# Altium schematic sheet Power.SchDoc: Power
size A4; Date: Not used; ApprovedBy: Not used; CheckedBy: Not used; Author: Not used; CompanyName: STMicroelectronics; DrawnBy: Not used; Engineer: Not used; Organization: Not used; Address1: Not used; Address2: Not used; Address3: Not used; Address4: Not used; DocumentNumber: Not used; Revision: Not used; SheetNumber: 5; SheetTotal: 7; CurrentTime: Not used; CurrentDate: Not used; Time: Not used; DocumentFullPathAndName: Not used; DocumentName: Not used; ModifiedDate: Not used; ImagePath: Not used; ProjectName: Not used; Application_BuildNumber: Not used
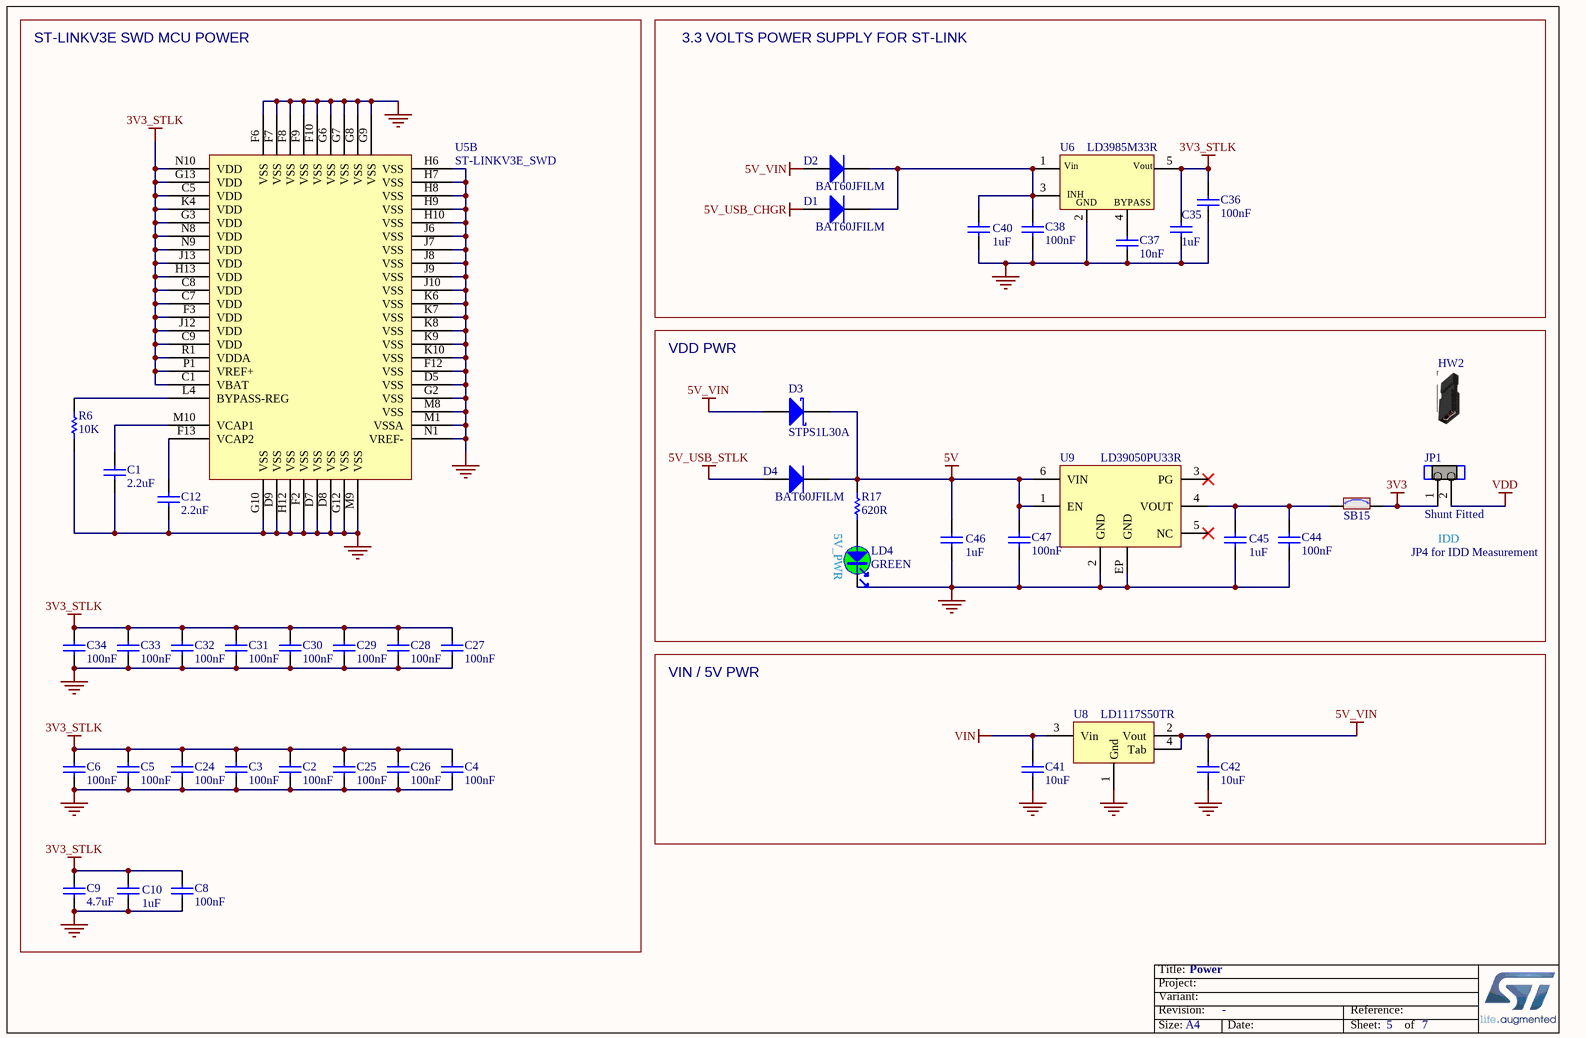
[diagram p0: Power.SchDoc]

## Parts
C1  value 2.2uF  [C0603]
C2  value 100nF  [C0402]
C3  value 100nF  [C0402]
C4  value 100nF  [C0402]
C5  value 100nF  [C0402]
C6  value 100nF  [C0402]
C8  value 100nF  [C0402]
C9  value 4.7uF  [C0603]
C10  value 1uF  [C0603]
C12  value 2.2uF  [C0603]
C24  value 100nF  [C0402]
C25  value 100nF  [C0402]
C26  value 100nF  [C0402]
C27  value 100nF  [C0402]
C28  value 100nF  [C0402]
C29  value 100nF  [C0402]
C30  value 100nF  [C0402]
C31  value 100nF  [C0402]
C32  value 100nF  [C0402]
C33  value 100nF  [C0402]
C34  value 100nF  [C0402]
C35  value 1uF  [C0603]
C36  value 100nF  [C0402]
C37  value 10nF  [C0402]
C38  value 100nF  [C0402]
C40  value 1uF  [C0603]
C41  value 10uF  [C0805]
C42  value 10uF  [C0805]
C44  value 100nF  [C0402]
C45  value 1uF  [C0603]
C46  value 1uF  [C0603]
C47  value 100nF  [C0402]
D1  value BAT60JFILM  [DIO_SOD323]
D2  value BAT60JFILM  [DIO_SOD323]
D3  value STPS1L30A  [DIO_SMA_1A_2K]
D4  value BAT60JFILM  [DIO_SOD323]
HW2  (no value)  (mechanical)
JP1  value Shunt Fitted  [CON_WP_707-2-02-2-20-00]
LD4  value GREEN  [LED_0603_GREEN]
R6  value 10K  [R0402]
R17  value 620R  [R0402]
SB15  (no value)  [SOLDER-BRIDGE_R0603-0R]
U5  value ST-LINKV3E_SWD  [ICC_UFBGA201_176+25_10X10_P065]  (part B of 2)
U6  value LD3985M33R  [REG_SOT23-5L]
U8  value LD1117S50TR  [REG_SOT223-TAB]
U9  value LD39050PU33R  [ICC_DFN6-EPAD_3X3_P095]

## Blocks framed on the sheet
ST-LINKV3E SWD MCU POWER: C1-C6 C8-C10 C12 C24-C34 R6 U5
3.3 VOLTS POWER SUPPLY FOR ST-LINK: C35-C38 C40 D1 D2 U6
VDD PWR: C44-C47 D3 D4 HW2 JP1 LD4 R17 SB15 U9
VIN / 5V PWR: C41 C42 U8

## Nets
3V3: JP1.1 SB15.2
3V3_STLK: C2.2 C3.2 C4.2 C5.2 C6.2 C8.2 C9.2 C10.2 C24.2 C25.2 C26.2 C27.2 C28.2 C29.2 C30.2 C31.2 C32.2 C33.2 C34.2 C35.2 C36.2 U5.C1(VBAT) U5.C5(VDD) U5.C7(VDD) U5.C8(VDD) U5.C9(VDD) U5.F3(VDD) U5.G3(VDD) U5.G13(VDD) U5.H13(VDD) U5.J12(VDD) U5.J13(VDD) U5.K4(VDD) U5.N8(VDD) U5.N9(VDD) U5.N10(VDD) U5.P1(VREF+) U5.R1(VDDA) U6.5(Vout)
5V: C46.2 C47.2 D3.2(K) D4.2(K) R17.2 U9.1(EN) U9.6(VIN)
5V_USB_CHGR: D1.1(A)
5V_USB_STLK: D4.1(A)
5V_VIN: C42.2 D2.1(A) D3.1(A) U8.2(Vout) U8.4(Tab)
GND: C1.1 C2.1 C3.1 C4.1 C5.1 C6.1 C8.1 C9.1 C10.1 C12.1 C24.1 C25.1 C26.1 C27.1 C28.1 C29.1 C30.1 C31.1 C32.1 C33.1 C34.1 C35.1 C36.1 C37.1 C38.1 C40.1 C41.1 C42.1 C44.1 C45.1 C46.1 C47.1 LD4.2 R6.1 U5.D5(VSS) U5.D7(VSS) U5.D8(VSS) U5.D9(VSS) U5.F2(VSS) U5.F6(VSS) U5.F7(VSS) U5.F8(VSS) U5.F9(VSS) U5.F10(VSS) U5.F12(VSS) U5.G2(VSS) U5.G6(VSS) U5.G7(VSS) U5.G8(VSS) U5.G9(VSS) U5.G10(VSS) U5.G12(VSS) U5.H6(VSS) U5.H7(VSS) U5.H8(VSS) U5.H9(VSS) U5.H10(VSS) U5.H12(VSS) U5.J6(VSS) U5.J7(VSS) U5.J8(VSS) U5.J9(VSS) U5.J10(VSS) U5.K6(VSS) U5.K7(VSS) U5.K8(VSS) U5.K9(VSS) U5.K10(VSS) U5.M1(VSSA) U5.M8(VSS) U5.M9(VSS) U5.N1(VREF-) U6.2(GND) U8.1(Gnd) U9.2(GND) U9.EP(GND)
VDD: JP1.2
VIN: C41.2 U8.3(Vin)
NetC1_2: C1.2 U5.M10(VCAP1)
NetC12_2: C12.2 U5.F13(VCAP2)
NetC37_2: C37.2 U6.4(BYPASS)
NetC38_2: C38.2 C40.2 D1.2(K) D2.2(K) U6.1(Vin) U6.3(CE)
NetC44_2: C44.2 C45.2 SB15.1 U9.4(VOUT)
NetLD4_1: LD4.1 R17.1
NetR6_2: R6.2 U5.L4(BYPASS-REG)

Not connected (* = marked no-connect by the designer): U9 3(PG)* 5(NC)*

## Notes on the sheet
- 5V_PWR
- JP4 for IDD Measurement
- IDD
- Title:
- Project:
- Size:
- Revision:
- Variant:
- A4
- -
- Date:
- Reference:
- Sheet:
- of
- (in symbol MCD-00086) INH

## Library data of the parts
C1 C12 = MCD-00012: Capacitor, MLCC, 2.2uF, 10V, X5R, 10%, 0603, T=0,8mm; Manufacturer_Part_Number: CC0603KRX5R6BB225; Manufacturer: YAGEO; Alternate_Manufacturer_Part_Number: C0603C225K8PACTU; Alternate_Manufacturer: KEMET; Provided_By: SUBCO; Initial_Board_Reference: MB1274; Internal_Part_Number: MCD-00012; Status: Released; Part_Type: Capacitor; Package: C0603; ComponentLink1Description: Datasheet; ComponentLink1URL: http://tunmcdsvn.tun.st.com/Component_Datasheet_Library/Trunk/Capacitors/Yageo_Multilayer_capacitor_X5R_series_100pF_to_100uF
C2-C6 C8 C24-C34 C36 C38 C44 C47 = MCD-00102: Capacitor, MLCC, 100nF, 16V, X7R, 10%, 0402, T=0,5mm; Manufacturer_Part_Number: CC0402KRX7R7BB104; Manufacturer: YAGEO; Provided_By: SUBCO; Initial_Board_Reference: MB1262; Internal_Part_Number: MCD-00102; Status: Released; Package: C0402; ComponentLink1Description: Datasheet; Part_Type: Capacitor; ComponentLink1URL: http://tunmcdsvn.tun.st.com/Component_Datasheet_Library/Trunk/Capacitors/Yageo_Multilayer_Capacitor_X7R_series_100pF_to_22uF
C9 = MCD-00009: Capacitor, MLCC, 4.7uF, 16V, X5R, 10%, 0603, T=0.8mm; Manufacturer_Part_Number: CC0603KRX5R7BB475; Manufacturer: YAGEO; Provided_By: SUBCO; Initial_Board_Reference: MB1274; Internal_Part_Number: MCD-00009; Status: Released; Part_Type: Capacitor; Package: C0603; ComponentLink1Description: Datasheet; ComponentLink1URL: http://tunmcdsvn.tun.st.com/Component_Datasheet_Library/Trunk/Capacitors/Yageo_Multilayer_capacitor_X5R_series_100pF_to_100uF
C10 C35 C40 C45 C46 = MCD-00010: Capacitor, MLCC, 1uF, 16V, X5R, 10%, 0603, T=0,8mm; Manufacturer_Part_Number: CC0603KRX5R7BB105; Manufacturer: YAGEO; Provided_By: SUBCO; Initial_Board_Reference: MB1274; Internal_Part_Number: MCD-00010; Status: Released; Package: C0603; ComponentLink1Description: Datasheet; Part_Type: Capacitor; ComponentLink1URL: http://tunmcdsvn.tun.st.com/Component_Datasheet_Library/Trunk/Capacitors/Yageo_Multilayer_capacitor_X5R_series_100pF_to_100uF
C37 = MCD-00011: Capacitor, MLCC, 10nF, 16V, X7R, 10%, 0402, T=0.5mm; Manufacturer_Part_Number: CC0402KRX7R7BB103; Manufacturer: YAGEO; Provided_By: SUBCO; Initial_Board_Reference: MB1274; Internal_Part_Number: MCD-00011; Status: Released; Part_Type: Capacitor; Package: C0402; ComponentLink1Description: Datasheet; ComponentLink1URL: http://tunmcdsvn.tun.st.com/Component_Datasheet_Library/Trunk/Capacitors/Yageo_Multilayer_Capacitor_X7R_series_100pF_to_22uF
C41 C42 = MCD-00014: Capacitor, MLCC, 10uF, 25V, X5R, 10%, 0805, T=0,85mm; Manufacturer_Part_Number: CC0805KRX5R8BB106; Manufacturer: YAGEO; Provided_By: SUBCO; Initial_Board_Reference: MB1274; Internal_Part_Number: MCD-00014; ComponentLink1Description: Datasheet; Status: Released; Part_Type: Capacitor; Package: C0805; ComponentLink1URL: http://tunmcdsvn.tun.st.com/Component_Datasheet_Library/Trunk/Capacitors/Yageo_Multilayer_capacitor_X5R_series_100pF_to_100uF
D1 D2 D4 = MCD-00034: BAT60JFILM; Manufacturer: STMICROELECTRONICS; Part_Type: Diode; BMS_Part_Number: 9151097; Provided_By: SUBCO with ST control; Initial_Board_Reference: MB1274; Internal_Part_Number: MCD-00034; Status: Released; Manufacturer_Part_Number: BAT60JFILM; ComponentLink1Description: Datasheet; ComponentLink1URL: http://tunmcdsvn.tun.st.com/Component_Datasheet_Library/Trunk/Diodes/STM_Diode_BAT60JFILM-SOD323
D3 = MCD-01059: LOW DROP POWER SCHOTTKY RECTIFIER 1A 30V VF=0.3V; Part_Type: Diode; Manufacturer: STMICROELECTRONICS; Provided_By: SUBCO with ST control; Initial_Board_Reference: MB1378; Internal_Part_Number: MCD-01059; Status: Footprint available; Manufacturer_Part_Number: STPS1L30A; Package: DIO_SMA_1A_2K; ComponentLink1Description: Datasheet; ComponentLink1URL: http://tunmcdsvn.tun.st.com/Component_Datasheet_Library/Trunk/Diodes/STM_SCHOTTKY_STPS1L30
HW2 = MCD-01409: SHUNT 1.27mm BLACK; Part_Type: Mechanical; Manufacturer: W & P Products; Alternate_Manufacturer_Part_Number: M50-1900005; Alternate_Manufacturer: HARWIN; Value: 266-101-10-00; Provided_By: SUBCO; Initial_Board_Reference: MB1441; Remark: mechanical parts no footprint. alt MCD-01389; Internal_Part_Number: MCD-01409; Status: Checked; Manufacturer_Part_Number: 266-101-10-00; ComponentLink1Description: Datasheet; ComponentLink1URL: http://tunmcdsvn.tun.st.com/Component_Datasheet_Library/Trunk/Connectors/WPPRO_Shunt_Jumper_266
JP1 = MCD-01428: Header, 2x1, 1,27mm, Right Angled, Single Row, Height 3.05mm/1.27mm; Part_Type: Connector; Manufacturer_Part_Number: 707-2-02-2-20-00; Manufacturer: W & P Products; Provided_By: SUBCO; Initial_Board_Reference: MB1441; Internal_Part_Number: MCD-01428; Status: Checked; ComponentLink1Description: Datasheet; ComponentLink1URL: http://tunmcdsvn.tun.st.com/Component_Datasheet_Library/Trunk/Connectors/WPPRO_connector_707-series
LD4 = MCD-00050: LED, Green, 0603; Part_Type: Display; Manufacturer_Part_Number: 19-213SYGC/S530-E2/TR8; Manufacturer: EVERLIGHT; Provided_By: SUBCO; Initial_Board_Reference: MB1274; Internal_Part_Number: MCD-00050; Status: Released; Package: LED 0603; ComponentLink1Description: Datasheet; ComponentLink1URL: http://tunmcdsvn.tun.st.com/Component_Datasheet_Library/Trunk/Display/Everlight_SMD-LED-GREEN_19-213SYGC-S530-XX-TR8-v3.doc
R6 = MCD-00053: Resistor,10K,0402,1%,1/16W; Manufacturer_Part_Number: RC0402FR-0710KL; Manufacturer: YAGEO; Provided_By: SUBCO; Initial_Board_Reference: MB1274; Internal_Part_Number: MCD-00053; Status: Released; ComponentLink1Description: Datasheet; Part_Type: Resistor; Package: R0402; ComponentLink1URL: http://tunmcdsvn.tun.st.com/Component_Datasheet_Library/Trunk/Resistors/Yageo_Resistor_RC0402-series
R17 = MCD-00499: Resistor,620R,0402,1%,1/16W; Manufacturer_Part_Number: RC0402FR-07620RL; Manufacturer: YAGEO; Provided_By: SUBCO; Initial_Board_Reference: MBxxxx; Internal_Part_Number: MCD-00499; Status: Released; Part_Type: Resistor; Package: R0402; ComponentLink1Description: Datasheet; ComponentLink1URL: http://tunmcdsvn.tun.st.com/Component_Datasheet_Library/Trunk/Resistors/Yageo_Resistor_RC0402-series
SB15 = MCD-00071: Solder Bridge ON; Part_Type: Mechanical; Manufacturer_Part_Number: RC0603JR-070RL; Manufacturer: YAGEO; Provided_By: SUBCO; Initial_Board_Reference: MB1274; Internal_Part_Number: MCD-00071; Status: Released; ComponentLink1Description: Datasheet; Package: SB0603; ComponentLink1URL: http://tunmcdsvn.tun.st.com/Component_Datasheet_Library/Trunk/Resistors/Yageo_Resistor_RC0603-series
U5 = MCD-00596: STM32F723IEK  (STM32F7) BGA176; Part_Type: IC; Manufacturer_Part_Number: STM32F723IEK6; Manufacturer: STMICROELECTRONICS; BMS_Part_Number: 9175300; Provided_By: SUBCO with ST control; Initial_Board_Reference: MB1331; Internal_Part_Number: MCD-00596; Status: Checked; ComponentLink1Description: Datasheet; ComponentLink1URL: http://tunmcdsvn.tun.st.com/Component_Datasheet_Library/Trunk/IC/BGA176+25L_10x10x0.6_pitch0.65
U6 = MCD-00086: Ultra low drop-low noise BiCMOS voltage, regulators low ESR capacitors compatible; Manufacturer: STMICROELECTRONICS; Part_Type: IC; BMS_Part_Number: 9176161; Provided_By: SUBCO with ST control; Initial_Board_Reference: MB1274; Internal_Part_Number: MCD-00086; Status: Released; Manufacturer_Part_Number: LD3985M33R; ComponentLink1Description: Datasheet; ComponentLink1URL: http://tunmcdsvn.tun.st.com/Component_Datasheet_Library/Trunk/IC/STM_LDO_LD3985
U8 = MCD-00088: IC REG LDO 5V 0.8A SOT223; Manufacturer: STMICROELECTRONICS; BMS_Part_Number: 9176133; Provided_By: SUBCO with ST control; Initial_Board_Reference: MB1274; Internal_Part_Number: MCD-00088; Manufacturer_Part_Number: LD1117S50TR; ComponentLink1Description: Datasheet; Status: Released; Part_Type: IC; ComponentLink1URL: http://tunmcdsvn.tun.st.com/Component_Datasheet_Library/Trunk/IC/STM_LDO_LD1117; Package: SOT-223
U9 = MCD-00215: Low quiescent current and low noise voltage regulators; Manufacturer: STMICROELECTRONICS; Part_Type: IC; Provided_By: SUBCO with ST control; Initial_Board_Reference: MB1319; Internal_Part_Number: MCD-00215; Manufacturer_Part_Number: LD39050PU33R; Status: Released; ComponentLink1Description: Datasheet; ComponentLink1URL: http://tunmcdsvn.tun.st.com/Component_Datasheet_Library/Trunk/IC/STM_LDO_LD39050PU; Package: DFN6 3x3mm